# EAGLE schematic midiVolume (EAGLE 5.10)
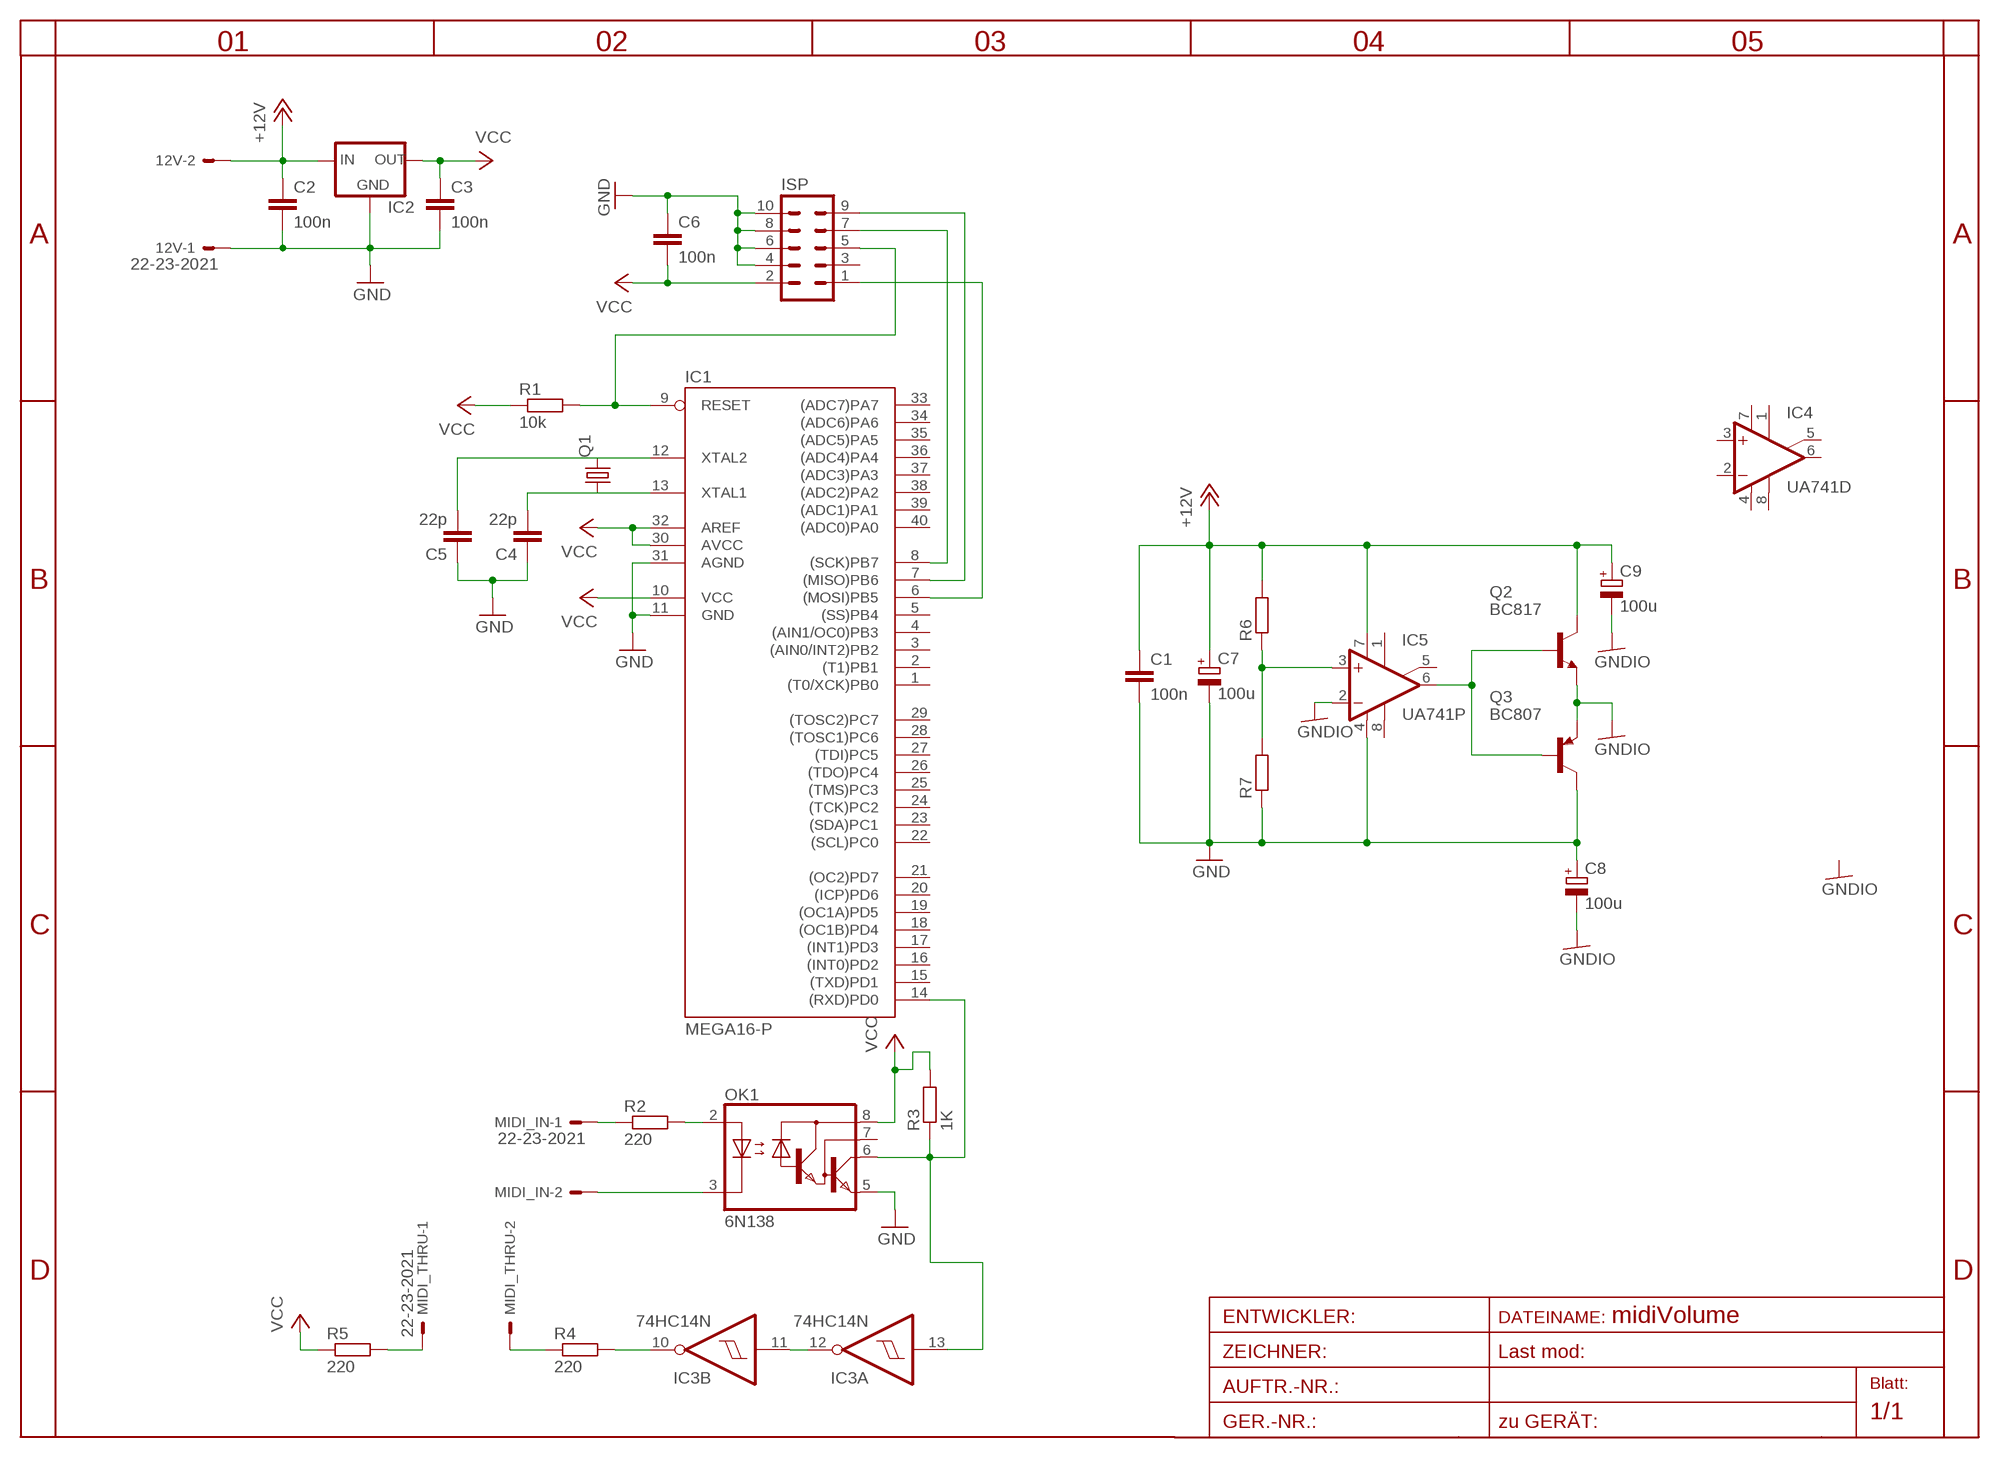
[diagram p0: schematic, sheet 1]

## Parts
12V  22-23-2021  [22-23-2021]
C1  100n  C-EU025-024X044  [C025-024X044]
C2  100n  C-EU025-024X044  [C025-024X044]
C3  100n  C-EU025-024X044  [C025-024X044]
C4  22p  C-EU025-024X044  [C025-024X044]
C5  22p  C-EU025-024X044  [C025-024X044]
C6  100n  C-EU025-024X044  [C025-024X044]
C7  100u  CPOL-EUD  [PANASONIC_D]
C8  100u  CPOL-EUD  [PANASONIC_D]
C9  100u  CPOL-EUD  [PANASONIC_D]
IC1  MEGA16-P  [DIL40]
IC2  78XXL  [78XXL]
IC3  74HC14N  [DIL14]
IC4  UA741D  [SO08]
IC5  UA741P  [DIL08]
ISP  ML10  [ML10]
MIDI_IN  22-23-2021  [22-23-2021]
MIDI_THRU  22-23-2021  [22-23-2021]
OK1  6N138  [DIL08]
Q1  CRYSTALHC49S  [HC49/S]
Q2  BC817  BCV72SMD  [SOT23-BEC]
Q3  BC807  BF823SMD  [SOT23-BEC]
R1  10k  R-EU_0207/10  [0207/10]
R2  220  R-EU_M1206  [M1206]
R3  1K  R-EU_M1206  [M1206]
R4  220  R-EU_0207/12  [0207/12]
R5  220  R-EU_0207/10  [0207/10]
R6  R-EU_R0603  [R0603]
R7  R-EU_R0603  [R0603]

## Nets
+12V: 12V.2 C1.1 C2.1 C7.+ C9.+ IC2.IN IC5.7(V+) Q2.C R6.2
GND: 12V.1 C1.2 C2.2 C3.2 C4.1 C5.1 C6.1 C7.- C8.+ IC1.11(GND) IC1.31(AGND) IC2.GND IC5.4(V-) ISP.4 ISP.6 ISP.8 ISP.10 OK1.5(GND) Q3.C R7.1
GNDIO: C8.- C9.- IC5.2(-IN) Q2.E Q3.E
N$1: IC1.9(RESET) ISP.5 R1.2
N$2: IC1.8((SCK)PB7) ISP.7
N$3: IC1.7((MISO)PB6) ISP.9
N$4: C5.2 IC1.12(XTAL2) Q1.2
N$5: C4.2 IC1.13(XTAL1) Q1.1
N$6: IC1.6((MOSI)PB5) ISP.1
N$9: IC5.3(+IN) R6.1 R7.2
N$11: IC5.6(OUT) Q2.B Q3.B
N$28: MIDI_IN.1 R2.1
N$29: OK1.2(A) R2.2
N$30: MIDI_IN.2 OK1.3(C)
N$31: IC1.14((RXD)PD0) IC3.13(A:I) OK1.6(VO) R3.1
N$39: IC3.11(B:I) IC3.12(A:O)
N$40: IC3.10(B:O) R4.2
N$41: MIDI_THRU.1 R5.2
N$42: MIDI_THRU.2 R4.1
VCC: C3.1 C6.2 IC1.10(VCC) IC1.30(AVCC) IC1.32(AREF) IC2.OUT ISP.2 OK1.8(VCC) R1.1 R3.2 R5.1
Unconnected: IC1.1((T0/XCK)PB0) IC1.2((T1)PB1) IC1.3((AIN0/INT2)PB2) IC1.4((AIN1/OC0)PB3) IC1.5((SS)PB4) IC1.15((TXD)PD1) IC1.16((INT0)PD2) IC1.17((INT1)PD3) IC1.18((OC1B)PD4) IC1.19((OC1A)PD5) IC1.20((ICP)PD6) IC1.21((OC2)PD7) IC1.22((SCL)PC0) IC1.23((SDA)PC1) IC1.24((TCK)PC2) IC1.25((TMS)PC3) IC1.26((TDO)PC4) IC1.27((TDI)PC5) IC1.28((TOSC1)PC6) IC1.29((TOSC2)PC7) IC1.33((ADC7)PA7) IC1.34((ADC6)PA6) IC1.35((ADC5)PA5) IC1.36((ADC4)PA4) IC1.37((ADC3)PA3) IC1.38((ADC2)PA2) IC1.39((ADC1)PA1) IC1.40((ADC0)PA0) IC3.1(D:I) IC3.2(D:O) IC3.3(E:I) IC3.4(E:O) IC3.5(F:I) IC3.6(F:O) IC3.8(C:O) IC3.9(C:I) IC4.1(ON1) IC4.2(-IN) IC4.3(+IN) IC4.5(ON2) IC4.6(OUT) IC4.8(OPT) IC5.1(ON1) IC5.5(ON2) IC5.8(OPT) ISP.3 OK1.7(VB)

## Power pins joined to a net without a drawn wire
GND: IC3.7(P:GND)
V+: IC4.7(V+)
V-: IC4.4(V-)
VCC: IC3.14(P:VCC)

## Library data of the parts
12V MIDI_IN MIDI_THRU = con-molex:22-23-2021: .100" (2.54mm) Center Header - 2 Pin
C1-C6 = rcl:C-EU: CAPACITOR, European symbol
C7-C9 = rcl:CPOL-EU: POLARIZED CAPACITOR, European symbol
IC1 = atmel:MEGA16-P: MICROCONTROLLER 16 Kbytes FLASH 1 kbytes SRAM 512 bytes EEPROM USART 8-channel 10 bit ADC Source: avr.lbr
IC2 = v-reg:78XXL: VOLTAGE REGULATOR
IC3 = 74xx-eu:74*14: Hex schmitt trigger INVERTER
IC4 IC5 = linear:*741: OP AMP
ISP = con-harting-ml:ML10: HARTING
OK1 = optocoupler:6N138: MOTOROLA OPTO COUPLER
Q1 = crystal:CRYSTAL: CRYSTAL
Q2 = transistor-npn:BCV72*: NPN Transistor
Q3 = transistor-pnp:BF823*: PNP Transistror
R1-R7 = rcl:R-EU_: RESISTOR, European symbol

## Net classes
0 default: width 0.508 mm, drill 0.051 mm, clearance 0.127 mm
1 GND: width 0.762 mm